# Altium project esp01_relay_honggnoai.PrjPcb
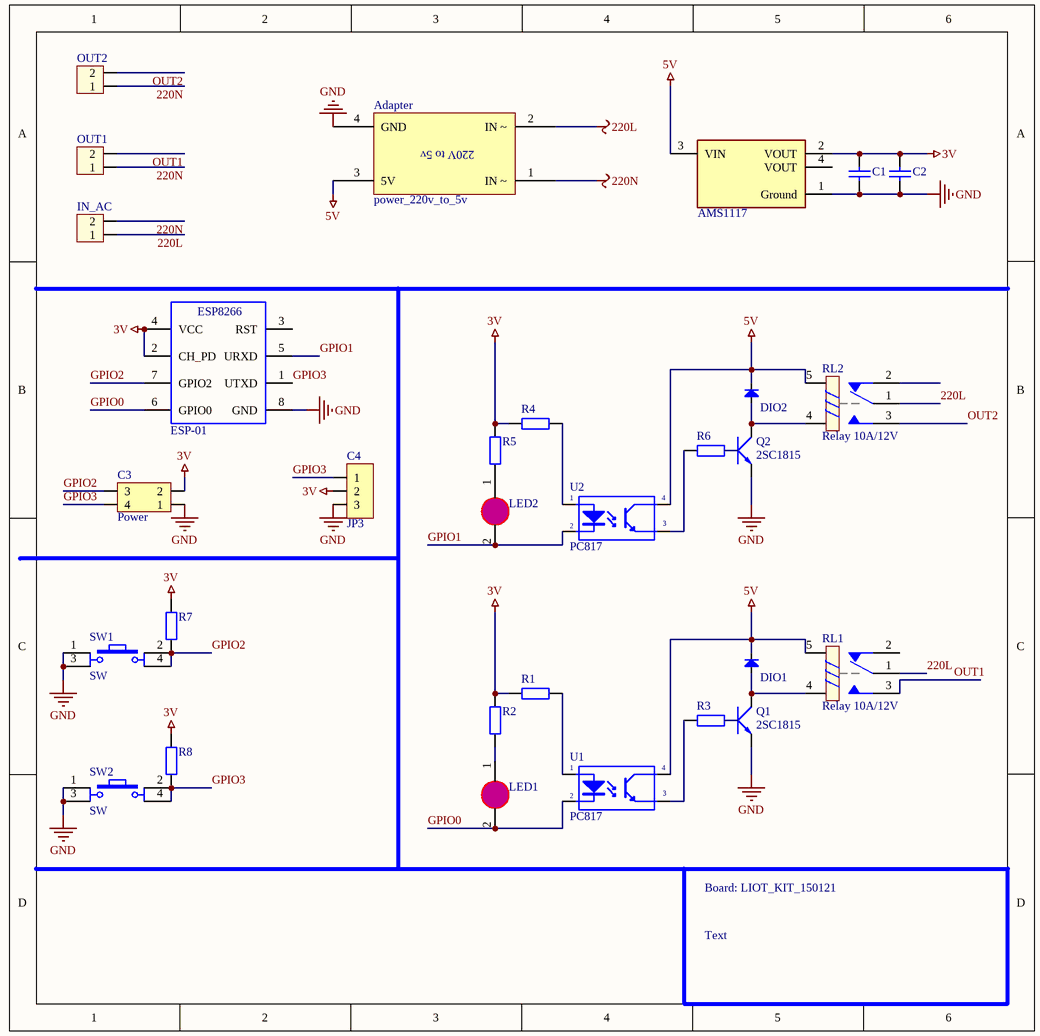
[diagram p0: esp_relay_hongngoai.SchDoc]
1 sheet, 30 parts. Net scope: global (net labels, ports and power ports of the same name join across sheets).
Board files: esp01_relay _hongngoai.PcbDoc, PCB1.PcbDoc

## Sheet esp_relay_hongngoai.SchDoc
size 193 x 193 mm

### Parts
Adapter  power_220v_to_5v  [power_220V_to_5V]
AMS1117  AMS1117-3.3  [Advanced_Monolithic_Systems_AMS1117_IPC_A]  (value not drawn)
C1  Capacitor Ceramic  [C0805]  (value not drawn)
C2  Capacitor Ceramic  [C0805]  (value not drawn)
C3  Power  [JP2-D2T]
C4  JP3  [JP3-D1T]
DIO1  Diode SMD  [DIO-SMD-106]  (value not drawn)
DIO2  Diode SMD  [DIO-SMD-106]  (value not drawn)
IN_AC  (no value)  [HED2]
LED1  (no value)  [LED0805]
LED2  (no value)  [LED0805]
OUT1  (no value)  [HED2]
OUT2  (no value)  [HED2]
Q1  2SC1815  [TO92-123]
Q2  2SC1815  [TO92-123]
R1  (no value)  [SM-0805]
R2  (no value)  [SM-0805]
R3  (no value)  [SM-0805]
R4  (no value)  [SM-0805]
R5  (no value)  [SM-0805]
R6  (no value)  [SM-0805]
R7  (no value)  [SM-0805]
R8  (no value)  [SM-0805]
RL1  Relay 10A/12V  [RL_SPDT_10A]
RL2  Relay 10A/12V  [RL_SPDT_10A]
SW1  SW  [SW4]
SW2  SW  [SW4]
U1  PC817  [DIP4]
U2  PC817  [DIP4]
U3  ESP-01  [ESP8266]

### Nets
3V: AMS1117.2(VOUT) C1.2 C2.2 C3.2 C4.2 R1.1 R2.2 R4.1 R5.2 R7.2 R8.2 U3.2(CH_PD) U3.4(VCC)
5V: Adapter.3(5V) AMS1117.3(VIN) DIO1.2(K) DIO2.2(K) RL1.5 RL2.5 U1.4(C) U2.4(C)
220L: Adapter.2(IN_~) IN_AC.1 RL1.1 RL2.1
220N: Adapter.1(IN_~) IN_AC.2 OUT1.1 OUT2.1
GND: Adapter.4(GND) AMS1117.1(Ground) C1.1 C2.1 C3.1 C4.3 Q1.1(E) Q2.1(E) SW1.1 SW1.3 SW2.1 SW2.3 U3.8(GND)
GPIO0: LED1.2(K) U1.2(K) U3.6(GPIO0)
GPIO1: LED2.2(K) U2.2(K) U3.5(URXD)
GPIO2: C3.3 R7.1 SW1.2 SW1.4 U3.7(GPIO2)
GPIO3: C3.4 C4.1 R8.1 SW2.2 SW2.4 U3.1(UTXD)
OUT1: OUT1.2 RL1.3
OUT2: OUT2.2 RL2.3
NetDIO1_1: DIO1.1(A) Q1.2(C) RL1.4
NetDIO2_1: DIO2.1(A) Q2.2(C) RL2.4
NetLED1_1: LED1.1(A) R2.1
NetLED2_1: LED2.1(A) R5.1
NetQ1_3: Q1.3(B) R3.2
NetQ2_3: Q2.3(B) R6.2
NetR1_2: R1.2 U1.1(A)
NetR3_1: R3.1 U1.3(E)
NetR4_2: R4.2 U2.1(A)
NetR6_1: R6.1 U2.3(E)

Not connected (* = marked no-connect by the designer): AMS1117 4(VOUT); RL1 2; RL2 2; U3 3(RST)

### Notes on the sheet
- Board: LIOT_KIT_150121
- Text
- (in symbol ESP8266-01) ESP8266
- (in symbol power_220v_to_5v) 220V to 5v

### Library data of the parts
C1 C2 = CapSMD: Capacitor; Value: 33p; Published: 8-Jun-2000; LatestRevisionDate: 17-Jul-2002; LatestRevisionNote: Re-released for DXP Platform.; PackageReference: RAD-0.3; Publisher: Altium Limited
C3 = JP2x2: WR-PHD 2.54 mm Dual Socket Header; Manufacturer: W¨¹rth Elektronik eiSos GmbH; partNo: 61300421821; ComponentLink1 Description: Manufacturer; ComponentLink2 Description: Datasheet; NoPins: 04; Created Date: 29 March 2013; ComponentLink1URL: http://www.we-online.com; ComponentLink2URL: http://katalog.we-online.de/em/datasheet/6130xx21821.pdf; Created by: Karrer Zheng
C4 = JP3: WR-PHD 2.54 mm Angled Socket Header; Manufacturer: W¨¹rth Elektronik eiSos GmbH; partNo: 613003143121; ComponentLink1 Description: Manufacturer; ComponentLink2 Description: Datasheet; NoPins: 03; Created Date: 29 March 2013; ComponentLink1URL: http://www.we-online.com; ComponentLink2URL: http://katalog.we-online.de/em/datasheet/6130xx143121.pdf; Created by: Karrer Zheng
DIO1 DIO2 = Diode SMD: Default Diode; Code - JEDEC: DO-214-AB; Value: 1N5007; Published: 8-Jun-2000; Revision: July-2002: Re-released for DXP Platform.; Publisher: Altium Limited
IN_AC OUT1 OUT2 = Hed2: Header 2 (Green); Value: Header 2
LED1 LED2 = LED0805: LED SMD 0805
Q1 Q2 = 2SC1815: NPN 600mW, ECB; Value: C1815
R1-R8 = RM: Resistor SMD; Value: 1K
RL1 RL2 = Relay 1: Relay SPDT,10A - 12VDC 5 Pin; Value: Relay SPDT, 10A, 12V
SW1 SW2 = SW4: Switch button 4 pin; Value: Button chip 4 pin
U1 U2 = PC817: Single Opto; Value: PC817
U3 = ESP8266-01: ESP-12 Wi-Fi Module